# EAGLE design Sensor LF (EAGLE 5.06)
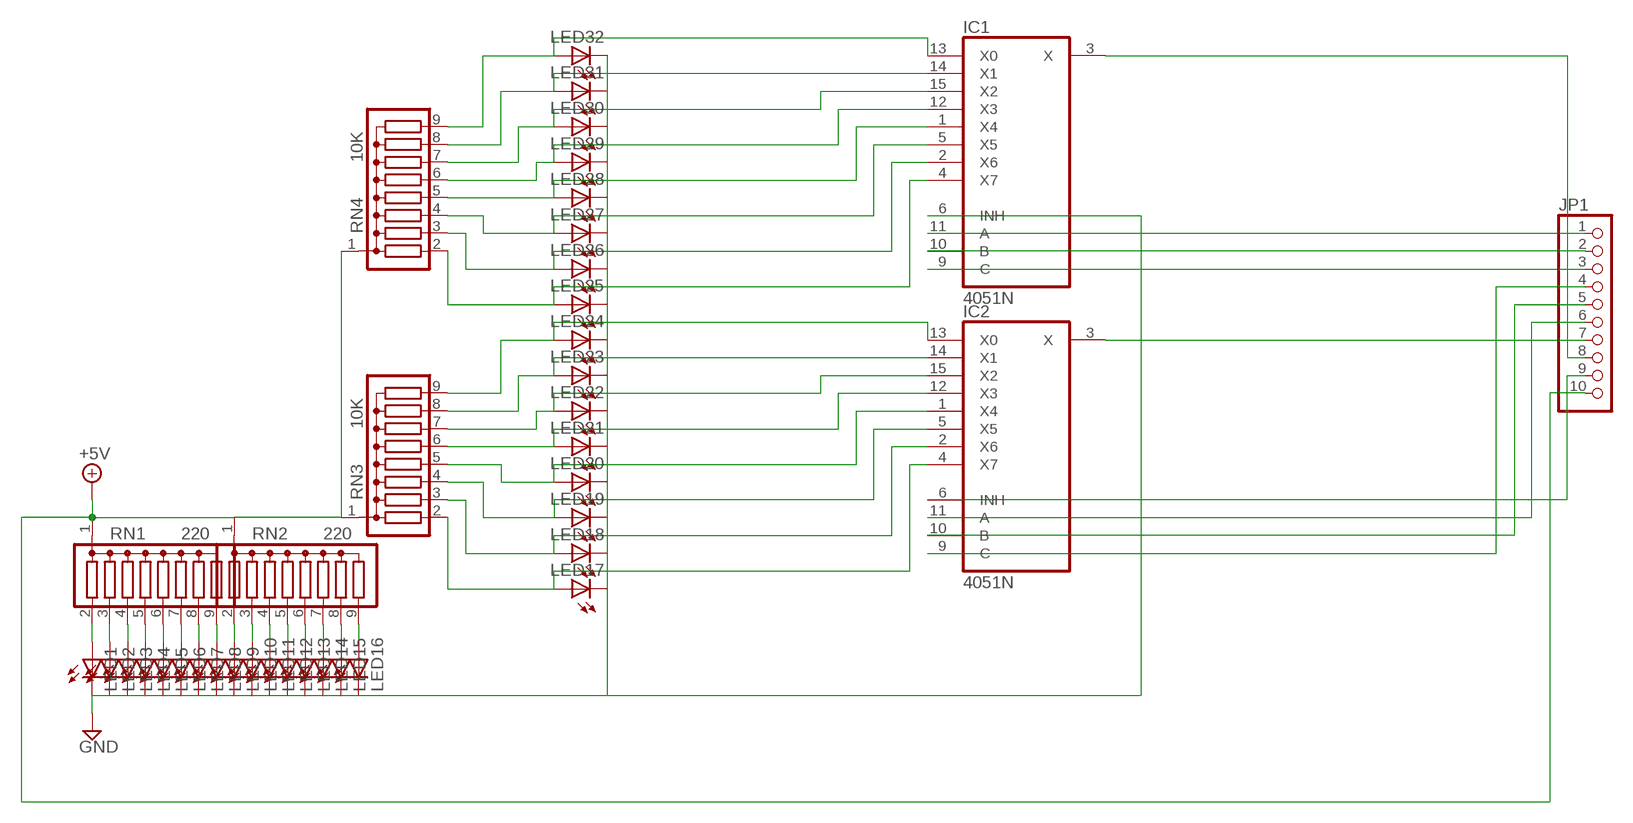
[diagram p0: schematic, sheet 1]

## Parts
IC1  4051N  [DIL16]
IC2  4051N  [DIL16]
JP1  PINHD-1X10  [1X10]
LED1  LED3MM  [LED3MM]
LED2  LED3MM  [LED3MM]
LED3  LED3MM  [LED3MM]
LED4  LED3MM  [LED3MM]
LED5  LED3MM  [LED3MM]
LED6  LED3MM  [LED3MM]
LED7  LED3MM  [LED3MM]
LED8  LED3MM  [LED3MM]
LED9  LED3MM  [LED3MM]
LED10  LED3MM  [LED3MM]
LED11  LED3MM  [LED3MM]
LED12  LED3MM  [LED3MM]
LED13  LED3MM  [LED3MM]
LED14  LED3MM  [LED3MM]
LED15  LED3MM  [LED3MM]
LED16  LED3MM  [LED3MM]
LED17  LED3MM  [LED3MM]
LED18  LED3MM  [LED3MM]
LED19  LED3MM  [LED3MM]
LED20  LED3MM  [LED3MM]
LED21  LED3MM  [LED3MM]
LED22  LED3MM  [LED3MM]
LED23  LED3MM  [LED3MM]
LED24  LED3MM  [LED3MM]
LED25  LED3MM  [LED3MM]
LED26  LED3MM  [LED3MM]
LED27  LED3MM  [LED3MM]
LED28  LED3MM  [LED3MM]
LED29  LED3MM  [LED3MM]
LED30  LED3MM  [LED3MM]
LED31  LED3MM  [LED3MM]
LED32  LED3MM  [LED3MM]
RN1  220  G08R  [SIL9]
RN2  220  G08R  [SIL9]
RN3  10K  G08R  [SIL9]
RN4  10K  G08R  [SIL9]

## Nets
+5V: JP1.10 RN1.1 RN2.1 RN3.1 RN4.1
GND: IC1.6(INH) IC2.6(INH) JP1.9 LED1.K(C) LED2.K(C) LED3.K(C) LED4.K(C) LED5.K(C) LED6.K(C) LED7.K(C) LED8.K(C) LED9.K(C) LED10.K(C) LED11.K(C) LED12.K(C) LED13.K(C) LED14.K(C) LED15.K(C) LED16.K(C) LED17.K(C) LED18.K(C) LED19.K(C) LED20.K(C) LED21.K(C) LED22.K(C) LED23.K(C) LED24.K(C) LED25.K(C) LED26.K(C) LED27.K(C) LED28.K(C) LED29.K(C) LED30.K(C) LED31.K(C) LED32.K(C)
N$1: IC1.10(B) JP1.2
N$2: IC1.9(C) JP1.3
N$3: IC2.11(A) JP1.6
N$4: IC2.10(B) JP1.5
N$5: IC2.9(C) JP1.4
N$6: IC2.3(X) JP1.7
N$15: LED1.A RN1.2
N$16: LED2.A RN1.3
N$17: IC2.4(X7) LED17.A RN3.2
N$18: IC2.2(X6) LED18.A RN3.3
N$19: IC2.5(X5) LED19.A RN3.4
N$20: IC2.1(X4) LED20.A RN3.5
N$21: IC2.12(X3) LED21.A RN3.6
N$22: IC2.15(X2) LED22.A RN3.7
N$23: IC2.14(X1) LED23.A RN3.8
N$24: IC2.13(X0) LED24.A RN3.9
N$25: IC1.4(X7) LED25.A RN4.2
N$26: IC1.2(X6) LED26.A RN4.3
N$27: IC1.5(X5) LED27.A RN4.4
N$28: IC1.1(X4) LED28.A RN4.5
N$29: IC1.12(X3) LED29.A RN4.6
N$30: IC1.15(X2) LED30.A RN4.7
N$31: IC1.14(X1) LED31.A RN4.8
N$32: IC1.13(X0) LED32.A RN4.9
N$33: LED3.A RN1.4
N$34: LED4.A RN1.5
N$35: LED5.A RN1.6
N$36: LED6.A RN1.7
N$37: LED7.A RN1.8
N$38: LED8.A RN1.9
N$39: LED9.A RN2.2
N$40: LED10.A RN2.3
N$41: LED11.A RN2.4
N$42: LED12.A RN2.5
N$43: LED13.A RN2.6
N$44: LED14.A RN2.7
N$45: LED15.A RN2.8
N$46: LED16.A RN2.9
N$47: IC1.3(X) JP1.8
N$49: IC1.11(A) JP1.1

## Power pins joined to a net without a drawn wire
+5V: IC1.16(VCC) IC2.16(VCC)
GND: IC1.7(VEE) IC1.8(GND) IC2.7(VEE) IC2.8(GND)

## Library data of the parts
IC1 IC2 = 40xx:4051: 8-channel ANALOG MULTIPLEXER
JP1 = pinhead:PINHD-1X10: PIN HEADER
LED1-LED32 = led:LED: LED OSRAM: - CHIPLED LG R971, LG N971, LY N971, LG Q971, LY Q971, LO R971, LY R971 LH N974, LH R974 LS Q976, LO Q976, LY Q976 LO Q996 - Hyper CHIPLED LW Q18S LB Q993, LB Q99A, LB R99A - SideLED LS A670, LO A670, LY A670, LG A670, LP A670 LB A673, LV A673, LT A673, LW A673 LH A674 LY A675 LS A676, LA A676, LO A676, LY A676, LW A676 LS A679, LY A679, LG A679 - Hyper Micro SIDELED® LS Y876, LA Y876, LO Y876, LY Y876 LT Y87S - SmartLED LW L88C, LW L88S LB L89C, LB L89S, LG L890 LS L89K, LO L89K, LY L89K LS L896, LA L896, LO L896, LY L896 - TOPLED LS T670, LO T670, LY T670, LG T670, LP T670 LSG T670, LSP T670, LSY T670, LOP T670, LYG T670 LG T671, LOG T671, LSG T671 LB T673, LV T673, LT T673, LW T673 LH T674 LS T676, LA T676, LO T676, LY T676, LB T676, LH T676, LSB T676, LW T676 LB T67C, LV T67C, LT T67C, LS T67K, LO T67K, LY T67K, LW E67C LS E67B, LA E67B, LO E67B, LY E67B, LB E67C, LV E67C, LT E67C LW T67C LS T679, LY T679, LG T679 LS T770, LO T770, LY T770, LG T770, LP T770 LB T773, LV T773, LT T773, LW T773 LH T774 LS E675, LA E675, LY E675, LS T675 LS T776, LA T776, LO T776, LY T776, LB T776 LHGB T686 LT T68C, LB T68C - Hyper Mini TOPLED® LB M676 - Mini TOPLED Santana® LG M470 LS M47K, LO M47K, LY M47K Source: http://www.osram.convergy.de LUXEON: - LUMILED® LXK2-PW12-R00, LXK2-PW12-S00, LXK2-PW14-U00, LXK2-PW14-V00 LXK2-PM12-R00, LXK2-PM12-S00, LXK2-PM14-U00 LXK2-PE12-Q00, LXK2-PE12-R00, LXK2-PE12-S00, LXK2-PE14-T00, LXK2-PE14-U00 LXK2-PB12-K00, LXK2-PB12-L00, LXK2-PB12-M00, LXK2-PB14-N00, LXK2-PB14-P00, LXK2-PB14-Q00 LXK2-PR12-L00, LXK2-PR12-M00, LXK2-PR14-Q00, LXK2-PR14-R00 LXK2-PD12-Q00, LXK2-PD12-R00, LXK2-PD12-S00 LXK2-PH12-R00, LXK2-PH12-S00 LXK2-PL12-P00, LXK2-PL12-Q00, LXK2-PL12-R00 Source: www.luxeon.com KINGBRIGHT: KA-3528ASYC Source: www.kingbright.com
RN1-RN4 = resistor-sil:G08R: SIL RESISTOR

## Board
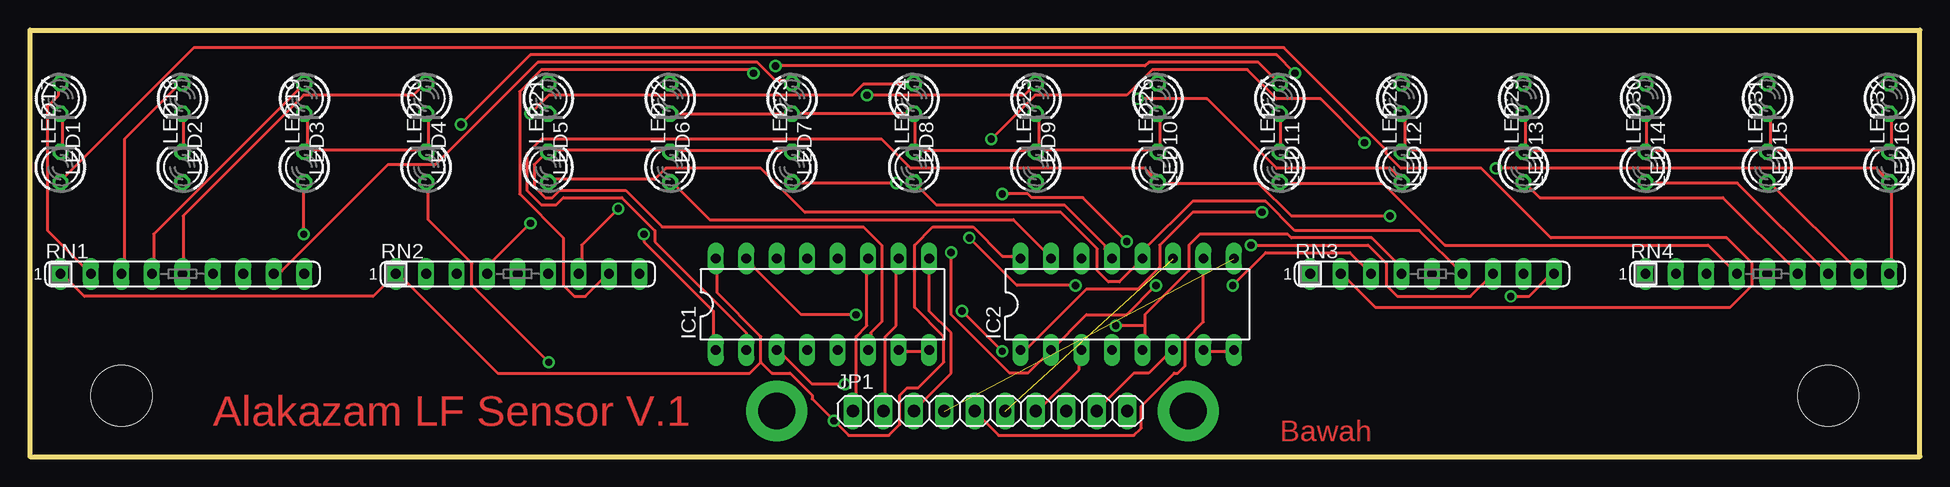
[diagram p1: board, top side]
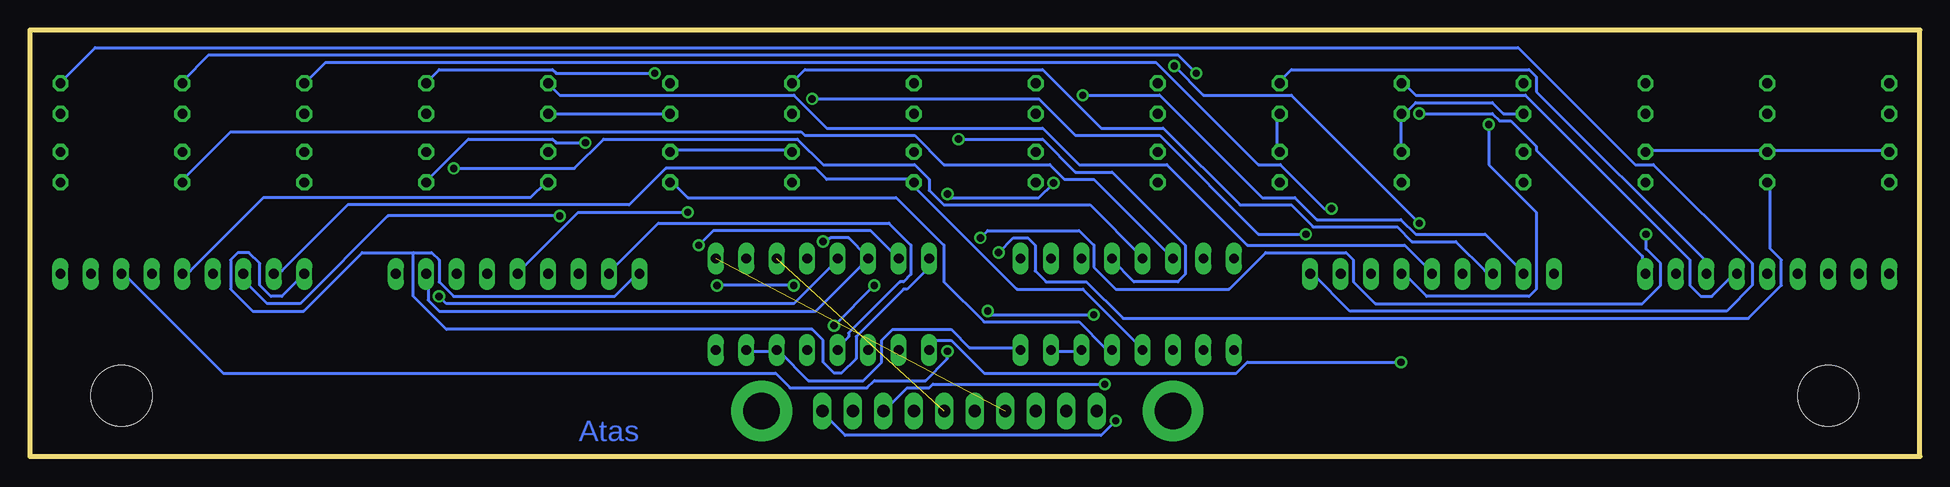
[diagram p2: board, bottom side, seen from below]

Size 157.48 x 35.56 mm. Coordinates in mm from the lower left corner, seen from the top.
Outline: 0,0 0,35.56 157.48,35.56 157.48,0 0,0
Copper layers (1*16): Top 0.035mm / dielectric 1.5mm / Bottom 0.035mm
Design rules "default": minimum track width 10mil, minimum drill 24mil, track to track 8mil, track to pad 8mil, pad to pad 8mil, via to via 8mil, smd to smd 8mil, copper to edge 40mil, drill to drill 8mil, minimum pad ring 10mil, minimum via ring 8mil, stop-mask expansion 4mil, vias tented up to drill 0mil, thermal gap 10mil
Holes 5.08 mm at 7.62,5.08 149.86,5.08

### Footprints (pad centres in the part's own frame; a part is rotated, then mirrored left to right if it is on the bottom)
DIL16 = drill 0.813 long: 1 -8.89,-3.81; 2 -6.35,-3.81; 3 -3.81,-3.81; 4 -1.27,-3.81; 5 1.27,-3.81; 6 3.81,-3.81; 7 6.35,-3.81; 8 8.89,-3.81; 9 8.89,3.81; 10 6.35,3.81; 11 3.81,3.81; 12 1.27,3.81; 13 -1.27,3.81; 14 -3.81,3.81; 15 -6.35,3.81; 16 -8.89,3.81
1X10 = drill 1.016 long: 1 -11.43,0; 2 -8.89,0; 3 -6.35,0; 4 -3.81,0; 5 -1.27,0; 6 1.27,0; 7 3.81,0; 8 6.35,0; 9 8.89,0; 10 11.43,0
LED3MM = drill 0.813 octagon: A -1.27,0; K 1.27,0
SIL9 = drill 0.813 long: 1 -10.16,0; 2 -7.62,0; 3 -5.08,0; 4 -2.54,0; 5 0,0; 6 2.54,0; 7 5.08,0; 8 7.62,0; 9 10.16,0

### Placement (x,y rotation side)
IC1  66.04,12.7 0 top
IC2  91.44,12.7 0 top
JP1  80.01,3.81 0 top
LED1  2.54,29.84 270 top
LED2  12.7,29.84 270 top
LED3  22.86,29.84 270 top
LED4  33.02,29.84 270 top
LED5  43.18,29.84 270 top
LED6  53.34,29.84 270 top
LED7  63.5,29.84 270 top
LED8  73.66,29.84 270 top
LED9  83.82,29.84 270 top
LED10  93.98,29.84 270 top
LED11  104.14,29.84 270 top
LED12  114.3,29.84 270 top
LED13  124.46,29.84 270 top
LED14  134.62,29.84 270 top
LED15  144.78,29.84 270 top
LED16  154.94,29.84 270 top
LED17  2.54,24.13 90 top
LED18  12.7,24.13 90 top
LED19  22.86,24.13 90 top
LED20  33.02,24.13 90 top
LED21  43.18,24.13 90 top
LED22  53.34,24.13 90 top
LED23  63.5,24.13 90 top
LED24  73.66,24.13 90 top
LED25  83.82,24.13 90 top
LED26  93.98,24.13 90 top
LED27  104.14,24.13 90 top
LED28  114.3,24.13 90 top
LED29  124.46,24.13 90 top
LED30  134.62,24.13 90 top
LED31  144.78,24.13 90 top
LED32  154.94,24.13 90 top
RN1  12.7,15.24 0 top
RN2  40.64,15.24 0 top
RN3  116.84,15.24 0 top
RN4  144.78,15.24 0 top

### Tracks (layer width: path | path; a pad name or v marks a point on that pad's centre or on a via)
+5V  (via drill 0.61)
  Top 0.254: RN1.1 2.69,15.19 4.52,13.36 28.6,13.36 RN2.1 30.73,15.19 38.96,6.96 59.99,6.96 60.91,7.87 | 60.91,7.87 60.91,10.01 57.25,13.67 57.25,16.41 IC1.16 | 60.91,7.87 61.82,6.96 63.35,6.96 65.18,5.13 65.18,4.83 v67.01,3 68.22,1.78 71.58,1.78 72.49,2.69 72.49,5.13 73.1,5.74 74.02,5.74 76.15,7.87 76.15,10.01 73.71,12.45 73.71,17.63 75.23,19.15 78.59,19.15 81.03,16.71 82.55,16.71 IC2.16
  Bottom 0.254: 125.53,17.02 129.79,17.02 134.67,12.14 138.94,12.14 140.77,13.97 140.77,16.41 140.16,17.02 139.24,17.02 138.33,16.1 138.33,14.28 137.41,13.36 136.5,13.36 RN4.1 | 125.53,17.02 124,17.02 123.39,16.41 123.39,14.58 122.17,13.36 108.76,13.36 106.93,15.19 RN3.1 | v67.01,3 68.22,1.78 89.56,1.78 91.39,3.61 JP1.10 | 125.53,17.02 125.53,13.36 122.78,10.62 92.3,10.62 91.39,9.7 91.39,7.87 90.48,6.96 89.87,6.96 88.65,8.18 88.65,10.01 84.68,13.97 84.38,13.97 82.55,15.8 IC2.16
GND
  Top 0.254: LED27.K 104.19,25.55 104.19,28.3 LED11.K | 84.07,25.55 84.07,28.3 LED9.K | LED10.K 94.13,28.3 94.13,25.55 LED26.K 93.83,25.55 84.07,25.55 | 84.07,25.55 LED25.K 83.77,25.55 73.71,25.55 | 145.03,25.55 145.03,28.3 LED15.K | LED16.K 155.09,28.3 155.09,25.55 LED32.K 154.79,25.55 145.03,25.55 | 145.03,25.55 LED31.K 144.73,25.55 134.67,25.55 | 134.67,25.55 134.67,28.3 LED14.K | 114.55,25.55 114.55,28.3 LED12.K | 124.61,25.55 124.61,28.3 LED13.K | 114.55,25.55 124.31,25.55 LED29.K 124.61,25.55 | 114.55,25.55 LED28.K | 124.61,25.55 134.37,25.55 LED30.K 134.67,25.55 | IC1.8 74.93,8.79 72.49,8.79 IC1.7 | IC2.8 100.23,8.79 97.79,8.79 IC2.7 | JP1.9 88.95,3.91 92,6.96 93.22,6.96 95.05,8.79 IC2.6 | LED17.K 2.69,25.55 2.69,28.3 LED1.K | LED18.K 12.75,25.55 12.75,28.3 LED2.K | 23.11,25.55 23.11,28.3 LED3.K | LED4.K 33.17,28.3 33.17,25.55 LED20.K 32.87,25.55 23.11,25.55 | 23.11,25.55 LED19.K | 73.71,25.55 73.71,28.3 LED8.K 73.41,28.6 63.65,28.6 LED7.K 63.35,28.6 53.59,28.6 LED6.K | LED23.K 63.35,25.55 53.59,25.55 LED22.K 53.29,25.55 43.23,25.55 LED21.K 42.93,25.25 42.01,24.33 42.01,22.5 42.93,21.59 43.54,21.59 44.14,22.2 49.63,22.2 52.68,19.15 69.44,19.15 70.97,17.63 70.97,11.23 70.05,10.31 70.05,9.09 IC1.6 | 73.71,25.55 LED24.K
  Bottom 0.254: LED27.K 103.89,25.55 94.13,25.55 LED26.K | LED11.K 104.19,28.6 114.25,28.6 LED12.K | IC1.6 70.05,8.79 72.19,8.79 IC1.7 | IC2.7 97.79,8.79 95.35,8.79 IC2.6 95.05,8.79 92.61,6.35 88.04,6.35 86.51,7.87 86.51,9.7 85.6,10.62 80.72,10.62 79.2,9.09 74.93,9.09 IC1.8 | LED17.K 2.69,25.55 12.45,25.55 LED18.K 12.75,25.55 22.81,25.55 LED19.K | LED21.K 43.23,25.55 43.23,28.3 LED5.K 42.93,28.6 42.01,29.52 35.61,29.52 34.7,28.6 33.17,28.6 LED4.K | LED22.K 53.59,25.55 53.59,28.3 LED6.K
N$1
  Top 0.254: IC1.10 72.19,16.41 72.19,10.92 71.27,10.01 71.27,3.91 JP1.2
N$2
  Top 0.254: IC1.9 74.93,12.14 76.76,10.31 76.76,6.96 73.71,3.91 JP1.3
N$3  (1 unrouted)
N$4
  Top 0.254: IC2.10 97.79,11.23 96.27,9.7 96.27,7.57 95.66,6.96 95.35,6.96 92.61,4.22 92.61,2.39 92,1.78 80.72,1.78 78.89,3.61 JP1.5
N$5  (1 unrouted)
N$6
  Top 0.254: IC2.3 87.43,8.79 87.43,7.26 84.07,3.91 JP1.7
N$7  (via drill 3.05 pad 5.08)
  other vias: 62.23,3.81
N$8  (via drill 3.05 pad 5.08)
  other vias: 96.52,3.81
N$15
  Top 0.254: RN1.2 1.47,18.85 1.47,29.21 2.39,30.12 2.39,31.04 LED1.A
N$16
  Top 0.254: RN1.3 7.87,15.49 7.87,26.47 12.45,31.04 LED2.A
N$17
  Top 0.254: LED17.A 2.69,23.11 13.67,34.09 104.5,34.09 113.03,25.55 113.03,25.25 114.25,24.03 120.95,24.03 126.75,18.24 141.38,18.24 143.51,16.1 143.51,14.28 141.68,12.45 112.12,12.45 109.37,15.19 RN3.2
  Bottom 0.254: IC2.4 90.17,9.09 89.26,10.01 89.26,10.31 84.99,14.58 84.68,14.58 84.07,15.19 84.07,17.63 85.9,19.46 105.11,19.46 109.07,15.49 RN3.2
N$18  (via drill 0.61)
  Top 0.254: v76.76,17.02 76.76,11.84 81.64,6.96 83.16,6.96 IC2.2 88.04,11.84 91.39,11.84 v93.83,14.28 | RN3.3 109.98,17.02 102.97,17.02 v100.23,14.28
  Bottom 0.254: v76.76,17.02 75.54,18.24 74.32,18.24 73.71,17.63 73.71,15.49 72.8,14.58 69.44,14.58 66.4,11.53 14.28,11.53 11.53,14.28 11.53,16.41 12.45,17.32 12.45,22.81 LED18.A | v93.83,14.28 v100.23,14.28
N$19  (via drill 0.61)
  Top 0.254: 92.91,10.92 92.91,11.84 96.57,15.49 96.57,17.63 97.48,18.54 104.8,18.54 105.11,18.24 111.81,18.24 114.55,15.49 RN3.4 | 92.91,10.92 92.91,9.09 IC2.5 | v22.81,18.54 22.81,22.81 LED19.A | v78.28,18.24 82.25,14.28 v87.12,14.28 | 92.91,10.92 v90.48,10.92
  Bottom 0.254: v22.81,18.54 22.81,17.32 21.59,16.1 21.59,14.28 23.11,12.75 45.36,12.75 47.19,14.58 47.19,16.41 47.8,17.02 54.51,17.02 57.56,13.97 67.01,13.97 68.83,15.8 68.83,17.63 70.05,18.85 77.67,18.85 v78.28,18.24 | v90.48,10.92 v87.12,14.28
N$20  (via drill 0.61)
  Top 0.254: v102.67,20.37 96.88,20.37 94.13,17.63 94.13,15.8 92.3,13.97 88.04,13.97 83.16,9.09 82.55,9.09 IC2.1 | v43.23,7.87 36.83,14.28 36.83,16.1 33.17,19.76 33.17,22.81 LED20.A
  Bottom 0.254: v102.67,20.37 111.81,20.37 116.69,15.49 RN3.5 | v43.23,7.87 56.03,7.87 56.95,6.96 77.98,6.96 80.72,9.7 81.94,9.7 82.55,9.09 IC2.1
N$21
  Top 0.254: RN3.6 115.77,18.85 105.41,18.85 102.97,21.28 96.88,21.28 92.91,17.32 92.91,16.71 IC2.12 90.78,14.58 89.87,14.58 88.95,15.49 88.95,17.32 85.9,20.37 64.57,20.37 60.91,24.03 52.98,24.03 52.07,23.11 43.23,23.11 LED21.A
N$22  (via drill 0.61)
  Top 0.254: IC2.15 84.99,16.71 81.94,19.76 56.64,19.76 53.59,22.81 LED22.A | RN3.7 120.04,13.36 113.94,13.36 113.03,14.28 113.03,16.1 111.51,17.63 v101.75,17.63
  Bottom 0.254: v101.75,17.63 100.53,18.85 87.43,18.85 IC2.15
N$23  (via drill 0.61)
  Top 0.254: v72.19,22.81 63.65,22.81 LED23.A | v81.03,21.89 83.16,21.89 83.46,21.59 87.73,21.59 v91.39,17.93
  Bottom 0.254: RN3.8 124.31,15.19 124.31,13.06 123.39,12.14 92,12.14 IC2.14 87.73,16.71 89.26,18.24 90.78,18.24 91.08,17.93 v91.39,17.93 | v72.19,22.81 73.41,21.59 80.72,21.59 v81.03,21.89
N$24  (via drill 0.61)
  Top 0.254: LED24.A 75.54,20.98 86.21,20.98 89.56,17.63 89.56,17.32 90.17,16.71 IC2.13 | v123.39,13.36 124.92,13.36 126.75,15.19 RN3.9
  Bottom 0.254: v123.39,13.36 122.78,12.75 93.83,12.75 90.17,16.41 IC2.13
N$25
  Bottom 0.254: IC1.4 64.87,9.09 69.75,13.97 75.23,13.97 84.07,22.81 LED25.A 84.07,23.11 91.08,23.11 92,24.03 104.5,24.03 107.54,20.98 131.01,20.98 136.5,15.49 137.11,15.49 RN4.2
N$26  (via drill 0.61)
  Top 0.254: IC1.2 59.69,10.31 52.07,17.93 52.07,18.85 49.33,21.59 44.45,21.59 43.84,20.98 42.62,20.98 41.4,22.2 41.4,25.25 42.62,26.47 70.97,26.47 73.41,24.03 92.91,24.03 93.83,23.11 LED26.A 94.13,22.81 102.36,22.81 105.11,20.07 v113.34,20.07
  Bottom 0.254: v113.34,20.07 127.66,20.07 134.98,12.75 137.72,12.75 139.55,14.58 139.55,15.19 RN4.3
N$27
  Top 0.254: RN4.4 139.85,17.63 117.91,17.63 112.73,22.81 104.19,22.81 LED27.A
  Bottom 0.254: IC1.5 67.31,9.09 67.92,9.09 70.05,11.23 77.98,11.23 81.33,14.58 81.33,17.63 85.29,21.59 102.67,21.59 103.89,22.81 LED27.A
N$28  (via drill 0.61)
  Top 0.254: v51.16,18.54 51.16,17.93 56.95,12.14 56.95,9.09 IC1.1 | v92.3,29.82 98.09,29.82 103.89,24.03 113.34,24.03 114.25,23.11 LED28.A
  Bottom 0.254: v51.16,18.54 55.12,18.54 63.35,26.77 70.36,26.77 73.41,29.82 v92.3,29.82 | RN4.5 144.73,15.49 144.12,15.49 138.02,21.59 115.77,21.59 114.55,22.81 LED28.A
N$29  (via drill 0.61)
  Top 0.254: v80.11,26.47 83.77,30.12 91.39,30.12 93.52,32.26 101.45,32.26 103.89,29.82 107.54,29.82 v111.2,26.16 | RN4.6 147.17,15.49 141.07,21.59 125.83,21.59 124.61,22.81 LED29.A
  Bottom 0.254: v80.11,26.47 73.1,26.47 70.36,23.72 67.31,23.72 61.21,17.63 61.21,15.19 61.82,14.58 65.48,14.58 67.31,16.41 IC1.12 | v111.2,26.16 113.64,26.16 113.94,26.47 120.95,26.47 124.31,23.11 LED29.A
N$30  (via drill 0.61)
  Top 0.254: v68.83,11.84 64.26,11.84 59.69,16.41 IC1.15 | v81.03,8.79 v77.67,12.14 | RN4.7 142.29,22.81 134.67,22.81 LED30.A
  Bottom 0.254: v68.83,11.84 77.37,11.84 v77.67,12.14 | v81.03,8.79 81.03,8.18 82.86,6.35 87.12,6.35 87.73,5.74 94.13,5.74 95.35,6.96 141.38,6.96 149.61,15.19 RN4.7
N$31
  Top 0.254: RN4.8 152.35,15.49 145.03,22.81 LED31.A
  Bottom 0.254: IC1.14 68.83,23.11 71.27,23.11 72.49,24.33 81.33,24.33 83.77,26.77 92.91,26.77 93.22,27.08 140.77,27.08 144.73,23.11 LED31.A
N$32  (via drill 0.61)
  Top 0.254: RN4.9 155.09,15.49 155.09,22.81 LED32.A 154.79,23.11 153.87,24.03 v122.17,24.03
  Bottom 0.254: v122.17,24.03 112.12,24.03 109.68,26.47 93.52,26.47 91.39,24.33 83.77,24.33 82.55,23.11 82.55,22.2 81.33,20.98 69.14,20.98 64.87,16.71 IC1.13
N$33
  Top 0.254: RN1.4 10.31,15.49 10.31,18.54 22.81,31.04 LED3.A
N$34
  Top 0.254: RN1.5 12.75,15.49 12.75,20.07 22.81,30.12 31.95,30.12 32.87,31.04 LED4.A
N$35
  Bottom 0.254: RN1.6 15.49,15.19 17.32,13.36 18.24,13.36 19.15,14.28 19.15,16.41 32.87,30.12 42.01,30.12 42.93,31.04 LED5.A
N$36
  Bottom 0.254: RN1.7 17.93,15.49 17.93,16.41 31.95,30.43 31.95,31.65 32.56,32.26 52.38,32.26 53.29,31.34 LED6.A
N$37
  Top 0.254: RN1.8 20.37,15.49 20.98,15.49 29.82,24.33 33.78,24.33 42.32,32.87 60.6,32.87 62.13,31.34 63.35,31.34 LED7.A
N$38  (via drill 0.61)
  Top 0.254: v41.71,28.6 43.23,30.12 68.53,30.12 69.44,31.04 73.41,31.04 LED8.A
  Bottom 0.254: v41.71,28.6 35.61,28.6 35,27.99 34.09,27.99 31.95,25.86 31.95,25.55 23.11,16.71 23.11,15.49 RN1.9
N$39  (via drill 0.61)
  Top 0.254: v69.75,30.12 82.86,30.12 83.77,31.04 LED9.A
  Bottom 0.254: v69.75,30.12 63.35,30.12 54.81,21.59 52.07,21.59 50.24,19.76 43.23,19.76 42.01,18.54 36.22,18.54 33.17,15.49 RN2.2
N$40
  Bottom 0.254: RN2.3 35.61,15.49 36.22,15.49 38.66,17.93 42.32,17.93 43.54,19.15 50.55,19.15 52.38,20.98 56.64,20.98 63.04,27.38 68.22,27.38 73.1,32.26 92.91,32.26 93.83,31.34 LED10.A
N$41  (via drill 0.61)
  Top 0.254: v41.71,19.46 38.35,16.1 38.35,15.49 RN2.4 | v62.13,32.56 92.91,32.56 93.22,32.87 102.36,32.87 103.89,31.34 LED11.A
  Bottom 0.254: v41.71,19.46 52.38,30.12 59.69,30.12 v62.13,32.56
N$42
  Bottom 0.254: RN2.5 40.79,15.49 42.93,17.63 56.03,17.63 62.74,24.33 70.05,24.33 73.1,27.38 91.08,27.38 93.83,30.12 113.34,30.12 114.25,31.04 LED12.A
N$43  (via drill 0.61)
  Top 0.254: v35.92,27.69 41.71,33.48 103.89,33.48 v105.41,31.95
  Bottom 0.254: v35.92,27.69 35.92,24.33 31.95,20.37 31.95,13.97 32.56,13.36 41.1,13.36 42.93,15.19 RN2.6 | v105.41,31.95 113.64,31.95 113.94,32.26 123.39,32.26 124.31,31.34 LED13.A
N$44  (via drill 0.61)
  Top 0.254: v49.02,20.68 45.97,17.63 45.97,15.49 RN2.7
  Bottom 0.254: v49.02,20.68 49.63,20.68 53.29,24.33 55.12,24.33 63.65,32.87 132.84,32.87 134.37,31.34 LED14.A
N$45  (via drill 0.61)
  Top 0.254: v60.3,31.95 59.99,32.26 42.62,32.26 40.79,30.43 40.79,21.89 44.45,18.24 44.45,14.28 45.36,13.36 46.28,13.36 48.11,15.19 RN2.8
  Bottom 0.254: v60.3,31.95 61.82,33.48 142.6,33.48 144.73,31.34 LED15.A
N$46
  Bottom 0.254: RN2.9 50.55,15.19 47.5,12.14 16.1,12.14 13.97,14.28 13.97,16.1 22.2,24.33 23.72,24.33 33.48,34.09 152.04,34.09 154.79,31.34 LED16.A
N$47  (via drill 0.61)
  Top 0.254: v67.92,6.05 65.18,6.05 62.43,8.79 IC1.3
  Bottom 0.254: v67.92,6.05 82.25,6.05 82.55,5.74 84.38,5.74 86.21,3.91 JP1.8
N$49
  Top 0.254: IC1.11 69.75,16.41 69.75,10.92 68.83,10.01 68.83,3.91 JP1.1

### Text on the board
Top: Alakazam LF Sensor V.1 | Bawah
Bottom: Atas